# Altium schematic sheet 通信遥控板.SchDoc
size A2
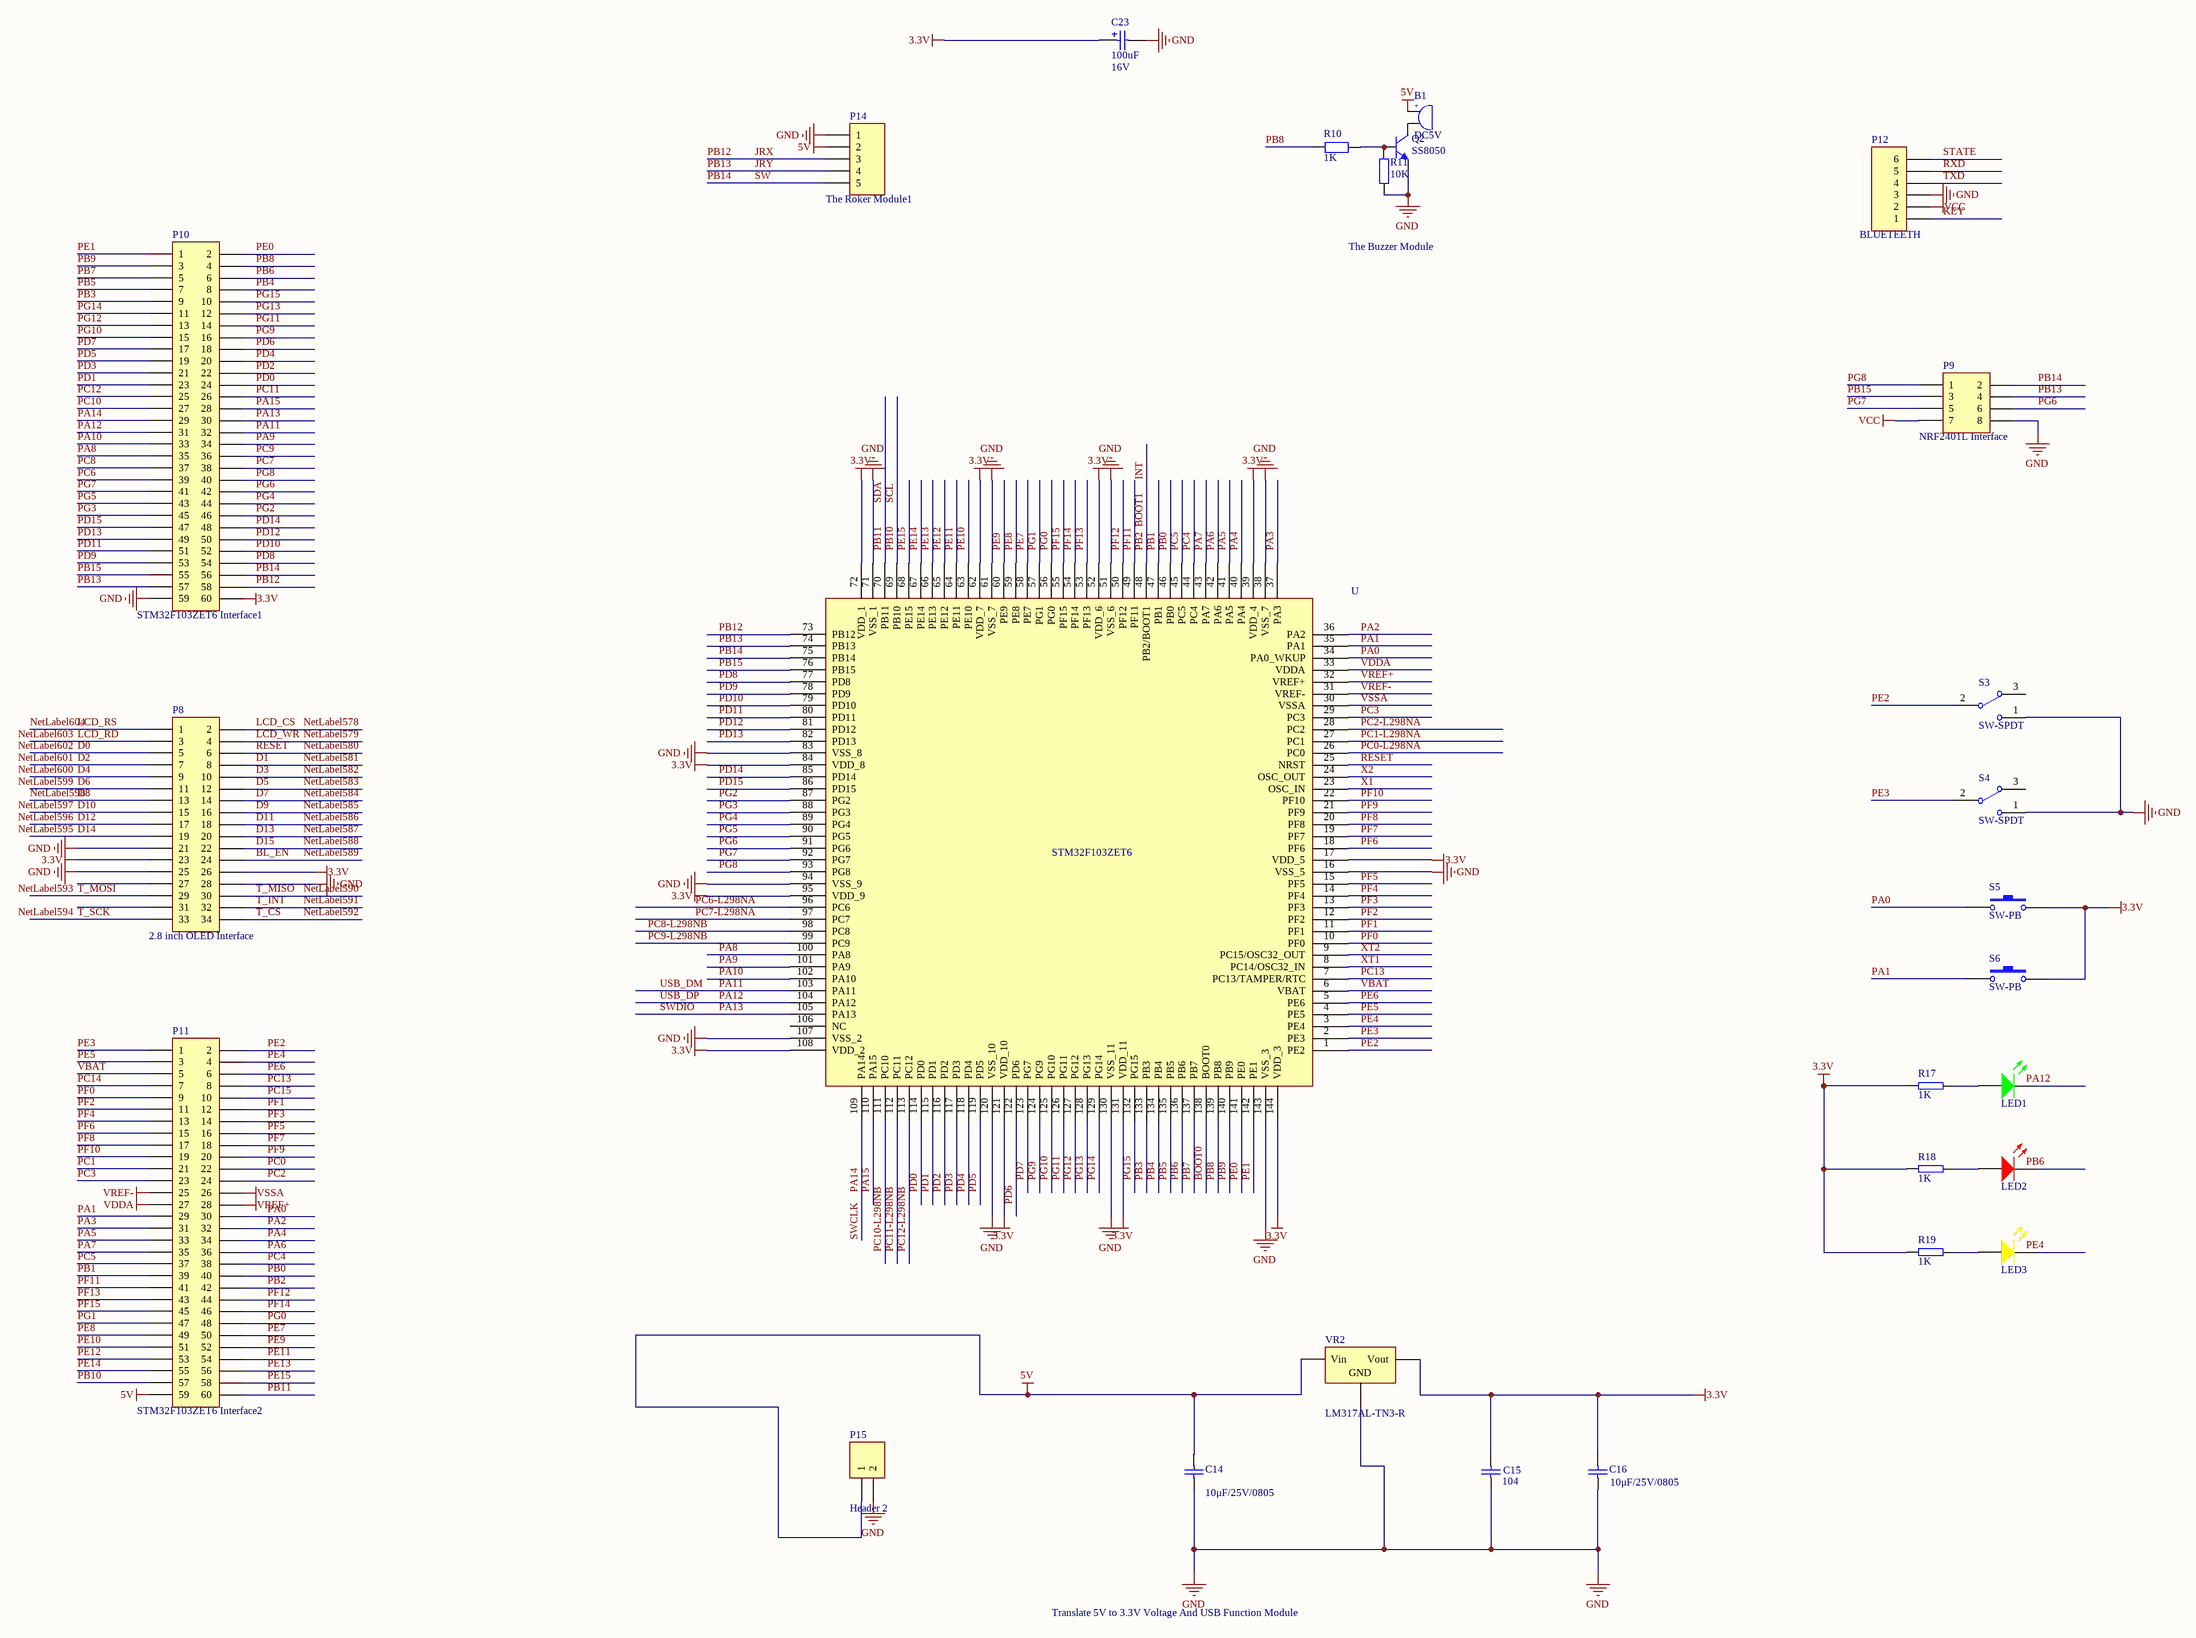
[diagram p0: 通信遥控板.SchDoc]

## Parts
B1  DC5V  [BEEP 6.5x12x8.5]
C14  value 10μF/25V/0805  [0805_C]  (hidden comment: Cap)
C15  value 104  [0805_C]  (hidden comment: Cap)
C16  value 10μF/25V/0805  [0805_C]  (hidden comment: Cap)
C23  Voltage: 16V  [CAPPR5-8X5]  (hidden comment: 100uF)
LED1  LED 3G  [LED-R3-H5-SINGLE-G]  (value not drawn)
LED2  LED 3R  [LED-R3-H5-SINGLE-R]  (value not drawn)
LED3  LED 3Y  [LED-R3-H5-SINGLE-Y]  (value not drawn)
P8  2.8 inch OLED Interface  [MHDR2X17]
P9  NRF2401L Interface  [MHDR2X4]
P10  STM32F103ZET6 Interface1  [HDR2X30]
P11  STM32F103ZET6 Interface2  [HDR2X30]
P12  BLUETEETH  [MHDR1X6]
P14  The Roker Module1  [HDR1X5H]
P15  Header 2  [HDR1X2]
Q2  SS8050  [TO92A]
R10  1K  [R 0805]
R11  10K  [R 0805]
R17  1K  [AXIAL-0.2]
R18  1K  [AXIAL-0.2]
R19  1K  [AXIAL-0.2]
S3  SW-SPDT  [TL36WW15050]
S4  SW-SPDT  [TL36WW15050]
S5  SW-PB  [SPST-2]
S6  SW-PB  [SPST-2]
U  Component_1  [LQFP-144_20x20x05P]  (value not drawn)
VR2  LM317AL-TN3-R  [TO-252-2-180]

## Nets
3.3V: C15.2 C16.2 C23.1 P8.23 P8.26 P10.60 R17.1 R18.1 R19.1 S5.2 S6.2 U.17(VDD_5) U.39(VDD_4) U.52(VDD_6) U.62(VDD_7) U.72(VDD_1) U.84(VDD_8) U.95(VDD_9) U.108(VDD_2) U.121(VDD_10) U.131(VDD_11) U.144(VDD_3) VR2.2(Vout)
5V: B1.1 C14.2 P11.59 P14.2 P15.1 VR2.3(Vin)
GND: C14.1 C15.1 C16.1 C23.2 P8.21 P8.25 P8.28 P9.8 P10.59 P12.3 P14.1 P15.2 Q2.1(E) R11.1 S3.1 S4.1 U.16(VSS_5) U.38(VSS_7) U.51(VSS_6) U.61(VSS_7) U.71(VSS_1) U.83(VSS_8) U.94(VSS_9) U.107(VSS_2) U.120(VSS_10) U.130(VSS_11) U.143(VSS_3) VR2.1(GND)
VCC: P9.7 P12.2
VDDA: P11.27 U.33(VDDA)
VREF+: P11.28 U.32(VREF+)
VREF-: P11.25 U.31(VREF-)
VSSA: P11.26 U.30(VSSA)
BL_EN: P8.24  [also labelled NetLabel589]
BOOT0: U.138(BOOT0)
BOOT1: P11.42 U.48(PB2/BOOT1)  [also labelled INT, PB2]
D0: P8.5
D1: P8.8  [also labelled NetLabel581]
D2: P8.7
D3: P8.10  [also labelled NetLabel582]
D4: P8.9
D5: P8.12  [also labelled NetLabel583]
D6: P8.11
D7: P8.14  [also labelled NetLabel584]
D8: P8.13  [also labelled NetLabel598]
D9: P8.16  [also labelled NetLabel585]
D10: P8.15
D11: P8.18  [also labelled NetLabel586]
D12: P8.17
D13: P8.20  [also labelled NetLabel587]
D14: P8.19
D15: P8.22  [also labelled NetLabel588]
JRX: P10.58 P14.3 U.73(PB12)  [also labelled PB12]
JRY: P9.4 P10.57 P14.4 U.74(PB13)  [also labelled PB13]
KEY: P12.1
LCD_CS: P8.2  [also labelled NetLabel578]
LCD_RD: P8.3
LCD_RS: P8.1  [also labelled NetLabel604]
LCD_WR: P8.4  [also labelled NetLabel579]
NetLabel580: P8.6 U.25(NRST)  [also labelled RESET]
NetLabel590: P8.30  [also labelled T_MISO]
NetLabel591: P8.32  [also labelled T_INT]
NetLabel592: P8.34  [also labelled T_CS]
PA0: P11.30 S5.1 U.34(PA0_WKUP)
PA1: P11.29 S6.1 U.35(PA1)
PA2: P11.32 U.36(PA2)
PA3: P11.31 U.37(PA3)
PA4: P11.34 U.40(PA4)
PA5: P11.33 U.41(PA5)
PA6: P11.36 U.42(PA6)
PA7: P11.35 U.43(PA7)
PA8: P10.35 U.100(PA8)
PA9: P10.34 U.101(PA9)
PA10: P10.33 U.102(PA10)
PA11: P10.32 U.103(PA11)  [also labelled USB_DM]
PA12: P10.31 U.104(PA12)  [also labelled USB_DP]
PA13: P10.30 U.105(PA13)  [also labelled SWDIO]
PA14: P10.29 U.109(PA14)  [also labelled SWCLK]
PA15: P10.28 U.110(PA15)
PB0: P11.40 U.46(PB0)
PB1: P11.39 U.47(PB1)
PB3: P10.9 U.133(PB3)
PB4: P10.8 U.134(PB4)
PB5: P10.7 U.135(PB5)
PB6: P10.6 U.136(PB6)
PB7: P10.5 U.137(PB7)
PB8: P10.4 R10.1 U.139(PB8)
PB9: P10.3 U.140(PB9)
PB10: P11.57 U.69(PB10)  [also labelled SCL]
PB11: P11.60 U.70(PB11)  [also labelled SDA]
PB14: P9.2 P10.56 P14.5 U.75(PB14)  [also labelled SW]
PB15: P9.3 P10.55 U.76(PB15)
PC0: P11.22
PC0-L298NA: U.26(PC0)
PC1: P11.21
PC1-L298NA: U.27(PC1)
PC2: P11.24
PC2-L298NA: U.28(PC2)
PC3: P11.23 U.29(PC3)
PC4: P11.38 U.44(PC4)
PC5: P11.37 U.45(PC5)
PC6: P10.39
PC6-L298NA: U.96(PC6)
PC7: P10.38
PC7-L298NA: U.97(PC7)
PC8: P10.37
PC8-L298NB: U.98(PC8)
PC9: P10.36
PC9-L298NB: U.99(PC9)
PC10: P10.27
PC10-L298NB: U.111(PC10)
PC11: P10.26
PC11-L298NB: U.112(PC11)
PC12: P10.25
PC12-L298NB: U.113(PC12)
PC13: P11.8 U.7(PC13/TAMPER/RTC)
PC14: P11.7
PC15: P11.10
PD0: P10.24 U.114(PD0)
PD1: P10.23 U.115(PD1)
PD2: P10.22 U.116(PD2)
PD3: P10.21 U.117(PD3)
PD4: P10.20 U.118(PD4)
PD5: P10.19 U.119(PD5)
PD6: P10.18 U.122(PD6)
PD7: P10.17 U.123(PG7)
PD8: P10.54 U.77(PD8)
PD9: P10.53 U.78(PD9)
PD10: P10.52 U.79(PD10)
PD11: P10.51 U.80(PD11)
PD12: P10.50 U.81(PD12)
PD13: P10.49 U.82(PD13)
PD14: P10.48 U.85(PD14)
PD15: P10.47 U.86(PD15)
PE0: P10.2 U.141(PE0)
PE1: P10.1 U.142(PE1)
PE2: P11.2 S3.2 U.1(PE2)
PE3: P11.1 S4.2 U.2(PE3)
PE4: P11.4 U.3(PE4)
PE5: P11.3 U.4(PE5)
PE6: P11.6 U.5(PE6)
PE7: P11.50 U.58(PE7)
PE8: P11.49 U.59(PE8)
PE9: P11.52 U.60(PE9)
PE10: P11.51 U.63(PE10)
PE11: P11.54 U.64(PE11)
PE12: P11.53 U.65(PE12)
PE13: P11.56 U.66(PE13)
PE14: P11.55 U.67(PE14)
PE15: P11.58 U.68(PE15)
PF0: P11.9 U.10(PF0)
PF1: P11.12 U.11(PF1)
PF2: P11.11 U.12(PF2)
PF3: P11.14 U.13(PF3)
PF4: P11.13 U.14(PF4)
PF5: P11.16 U.15(PF5)
PF6: P11.15 U.18(PF6)
PF7: P11.18 U.19(PF7)
PF8: P11.17 U.20(PF8)
PF9: P11.20 U.21(PF9)
PF10: P11.19 U.22(PF10)
PF11: P11.41 U.49(PF11)
PF12: P11.44 U.50(PF12)
PF13: P11.43 U.53(PF13)
PF14: P11.46 U.54(PF14)
PF15: P11.45 U.55(PF15)
PG0: P11.48 U.56(PG0)
PG1: P11.47 U.57(PG1)
PG2: P10.46 U.87(PG2)
PG3: P10.45 U.88(PG3)
PG4: P10.44 U.89(PG4)
PG5: P10.43 U.90(PG5)
PG6: P9.6 P10.42 U.91(PG6)
PG7: P9.5 P10.41 U.92(PG7)
PG8: P9.1 P10.40 U.93(PG8)
PG9: P10.16 U.124(PG9)
PG10: P10.15 U.125(PG10)
PG11: P10.14 U.126(PG11)
PG12: P10.13 U.127(PG12)
PG13: P10.12 U.128(PG13)
PG14: P10.11 U.129(PG14)
PG15: P10.10 U.132(PG15)
RXD: P12.5
STATE: P12.6
T_MOSI: P8.29
T_SCK: P8.33
TXD: P12.4
VBAT: P11.5 U.6(VBAT)
X1: U.23(OSC_IN)
X2: U.24(OSC_OUT)
XT1: U.8(PC14/OSC32_IN)
XT2: U.9(PC15/OSC32_OUT)
NetB1_2: B1.2 Q2.3(C)
NetLED1_1: LED1.1(A) R17.2
NetLED2_1: LED2.1(A) R18.2
NetLED3_1: LED3.1(A) R19.2
NetQ2_2: Q2.2(B) R10.2 R11.2

Not connected (* = marked no-connect by the designer): LED1 2(K); LED2 2(K); LED3 2(K); P8 27 31; S3 3; S4 3; U 106(NC)

## Notes on the sheet
- The Buzzer Module
- Translate 5V to 3.3V Voltage And USB Function Module
- Labels drawn without touching a wire or pin: NetLabel593, NetLabel594, NetLabel595, NetLabel596, NetLabel597, NetLabel599, NetLabel600, NetLabel601, NetLabel602, NetLabel603, PA12, PB6, PE4
- (in symbol BEEP) +
- (in symbol Component_1) STM32F103ZET6

## Library data of the parts
B1 = BEEP: 蜂鸣器; 版权归属: 源创客; BOM名称: 蜂鸣器; 学习资源: www.ooocke.com
C14-C16 = Cap: Capacitor; Published: 8-Jun-2000; LatestRevisionDate: 17-Jul-2002; LatestRevisionNote: Re-released for DXP Platform.; PackageReference: RAD-0.3; Publisher: Altium Limited; PackageDescription: Radial Cap, Thru-Hole; 2 Leads; 0.3 in Pin Spacing
C23 = Cap Pol 5-8: Polarized Capacitor (Radial); Published: 8-Jun-2000; Revision: July-2002: Re-released for DXP Platform.; Publisher: Altium Limited; Price(RMB): 0.000; Value: 100uF
LED1 = LED 3G: Green, 3mm, Typical INFRARED GaAs LED; Published: 8-Jun-2000; Revision: July-2002: Re-released for DXP Platform.; Publisher: Altium Limited; Price(RMB): 0.00
LED2 = LED 3R: Red, 3mm, Typical INFRARED GaAs LED; Published: 8-Jun-2000; Revision: July-2002: Re-released for DXP Platform.; Publisher: Altium Limited; Price(RMB): 0.00
LED3 = LED 3Y: Yellow, 3mm, Typical INFRARED GaAs LED; Published: 8-Jun-2000; Revision: July-2002: Re-released for DXP Platform.; Publisher: Altium Limited; Price(RMB): 0.00
P8 = MHDR2X17: Header, 17-Pin, Dual row; LatestRevisionDate: 17-Jul-2002; LatestRevisionNote: Re-released for DXP Platform.; Publisher: Altium Limited
P9 = MHDR2X4: Header, 4-Pin, Dual row; LatestRevisionDate: 17-Jul-2002; LatestRevisionNote: Re-released for DXP Platform.; Publisher: Altium Limited
P10 P11 = Header 30X2: Header, 30-Pin, Dual row; LatestRevisionDate: 17-Jul-2002; LatestRevisionNote: Re-released for DXP Platform.; Publisher: Altium Limited
P12 = MHDR1X6: Header, 6-Pin; LatestRevisionDate: 17-Jul-2002; LatestRevisionNote: Re-released for DXP Platform.; Publisher: Altium Limited
P14 = Header 5H: Header, 5-Pin, Right Angle; LatestRevisionDate: 17-Jul-2002; LatestRevisionNote: Re-released for DXP Platform.; Publisher: Altium Limited
P15 = Header 2: Header, 2-Pin; LatestRevisionDate: 17-Jul-2002; LatestRevisionNote: Re-released for DXP Platform.; Publisher: Altium Limited
Q2 = 8050-DIP: 高频放大-NPN型; 版权归属: 源创客; 属性: 40V 1.5A 1W 100MHZ; BOM名称: 高频放大-NPN型; 学习资源: www.ooocke.com
R10 R11 = R: 贴片电阻; 版权归属: 源创客; BOM名称: 贴片电阻; 学习资源: www.ooocke.com
R17-R19 = Res Dsct HM 2: Traditional Horizon Mount Discrete Axial Resistor; Tolerance: 5%; Published: 8-Jun-2000; Revision: July-2002: Re-released for DXP Platform.; Publisher: Altium Limited; Price(RMB): 0.000; Value: 1K
S3 S4 = SW-SPDT: SPDT Subminiature Toggle Switch, Right Angle Mounting, Vertical Actuation; Published: 24-Mar-1999; LatestRevisionDate: 17-Dec-2003; LatestRevisionNote: Schematic revised, PCB Footprint replaced.; DatasheetVersion: 05-Dec-2000; PackageReference: TL36WW15050; Publisher: Altium Limited; PackageDescription: Switch; 4 Leads; ComponentLink1Description: Manufacturer Link; ComponentLink1URL: http://www.apem.com
S5 S6 = SW-PB: Switch; Published: 24-Mar-1999; LatestRevisionDate: 17-Jul-2002; LatestRevisionNote: Re-released for DXP Platform.; PackageReference: SPST-2; Publisher: Altium Limited; PackageDescription: Switch; 2 Leads
VR2 = LM317AL-TN3-R: 低压差线性稳压(LDO)